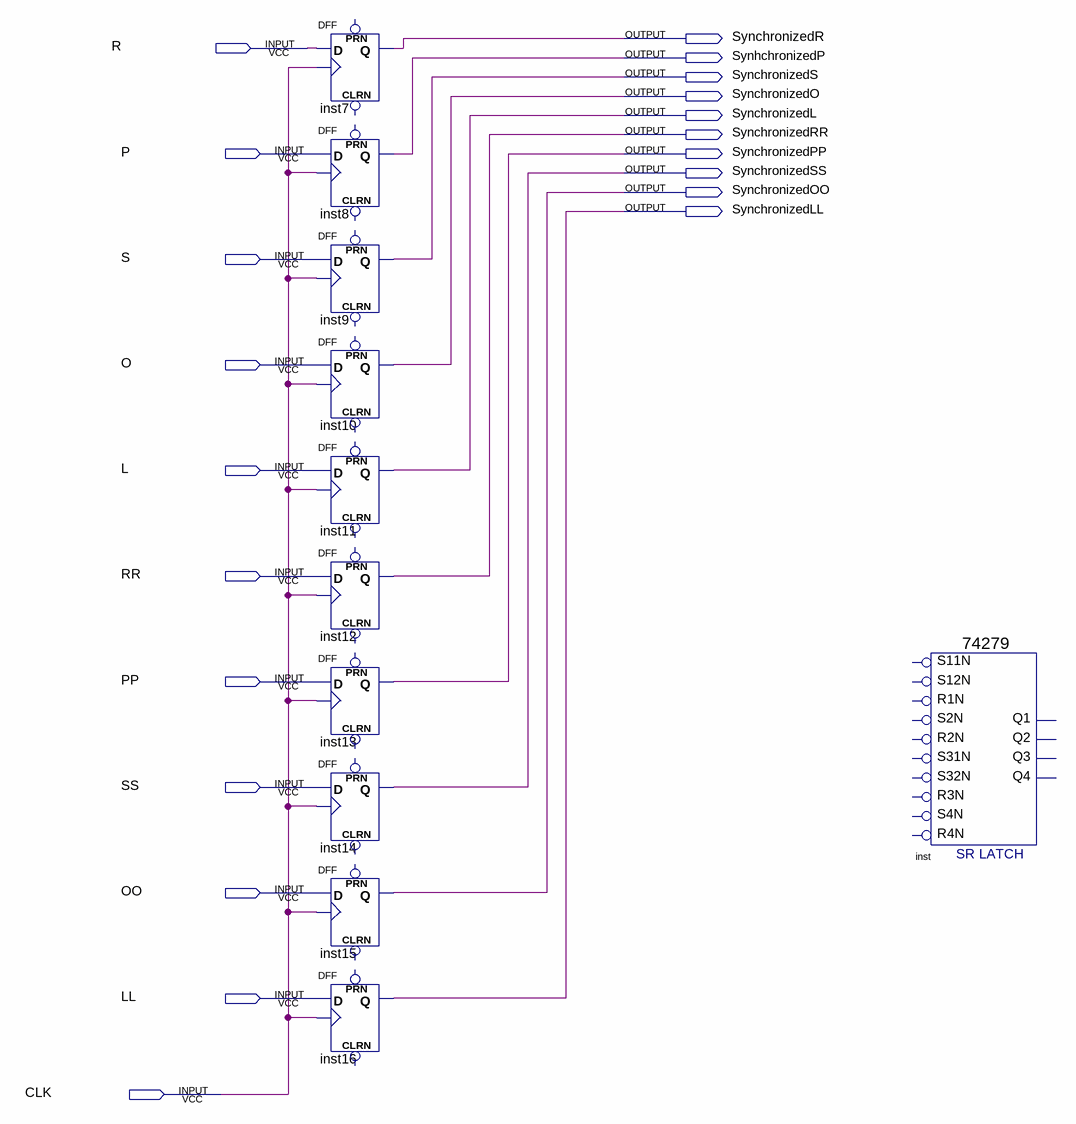
[diagram p0: schematic sheet]
// Quartus schematic InputsDFF.bdf as structural Verilog: 11 symbols, 21 pins
module InputsDFF (
  input  R,
  input  P,
  input  S,
  input  O,
  input  L,
  input  RR,
  input  PP,
  input  SS,
  input  OO,
  input  LL,
  input  CLK,
  output SynchronizedR,
  output SynhchronizedP,
  output SynchronizedS,
  output SynchronizedO,
  output SynchronizedL,
  output SynchronizedRR,
  output SynchronizedPP,
  output SynchronizedSS,
  output SynchronizedOO,
  output SynchronizedLL
);

  DFF inst7 (.CLK(CLK), .D(R), .Q(SynchronizedR));  // open: CLRN, PRN
  DFF inst8 (.CLK(CLK), .D(P), .Q(SynhchronizedP));  // open: CLRN, PRN
  DFF inst9 (.CLK(CLK), .D(S), .Q(SynchronizedS));  // open: CLRN, PRN
  DFF inst10 (.CLK(CLK), .D(O), .Q(SynchronizedO));  // open: CLRN, PRN
  DFF inst11 (.CLK(CLK), .D(L), .Q(SynchronizedL));  // open: CLRN, PRN
  DFF inst12 (.CLK(CLK), .D(RR), .Q(SynchronizedRR));  // open: CLRN, PRN
  DFF inst13 (.CLK(CLK), .D(PP), .Q(SynchronizedPP));  // open: CLRN, PRN
  DFF inst14 (.CLK(CLK), .D(SS), .Q(SynchronizedSS));  // open: CLRN, PRN
  DFF inst15 (.CLK(CLK), .D(OO), .Q(SynchronizedOO));  // open: CLRN, PRN
  DFF inst16 (.CLK(CLK), .D(LL), .Q(SynchronizedLL));  // open: CLRN, PRN
  \74279  inst ();  // open: R1N, S12N, S11N, R2N, S31N, S32N, S4N, R4N, S2N, R3N, Q2, Q1, Q3, Q4
endmodule
